# Altium schematic sheet CargaInalambrica.SchDoc
size A4
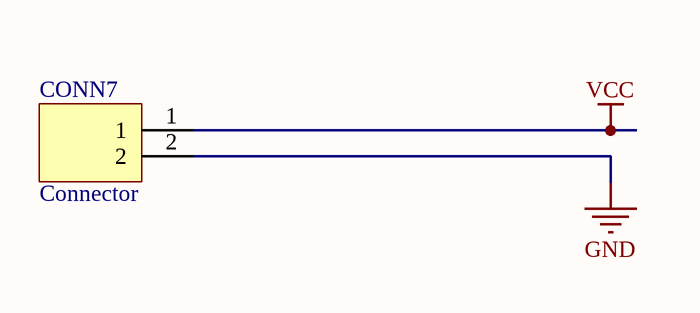
[diagram p0: CargaInalambrica.SchDoc]

## Parts
CONN7  Connector  [1x2x2.54 Pin Header TH V]

## Nets
GND: CONN7.2
VCC: CONN7.1

## Library data of the parts
CONN7 = Header 1x2: Con Batery